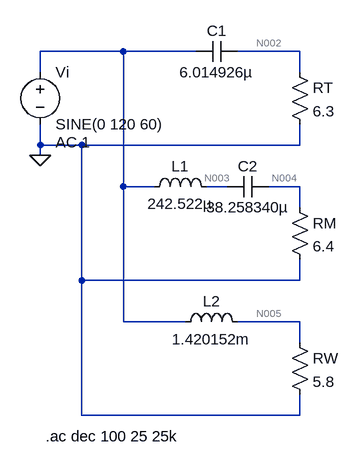
[diagram p0: schematic lab12.asc]
lab12.asc, the LTspice schematic file:
Version 4
SHEET 1 880 680
WIRE -112 -64 -240 -64
WIRE 0 -64 -112 -64
WIRE 160 -64 64 -64
WIRE -240 -32 -240 -64
WIRE 160 -32 160 -64
WIRE -240 80 -240 48
WIRE -176 80 -240 80
WIRE 160 80 160 48
WIRE 160 80 -176 80
WIRE -240 96 -240 80
WIRE -112 144 -112 -64
WIRE -64 144 -112 144
WIRE 48 144 16 144
WIRE 160 144 112 144
WIRE 160 176 160 144
WIRE -176 288 -176 80
WIRE 160 288 160 256
WIRE 160 288 -176 288
WIRE -112 352 -112 144
WIRE -16 352 -112 352
WIRE 160 352 64 352
WIRE 160 384 160 352
WIRE -176 496 -176 288
WIRE 160 496 160 464
WIRE 160 496 -176 496
FLAG -240 96 0
SYMBOL cap 0 -48 R270
WINDOW 0 32 32 VTop 2
WINDOW 3 0 32 VBottom 2
SYMATTR InstName C1
SYMATTR Value 6.014926µ
SYMBOL res 144 -48 R0
SYMATTR InstName RT
SYMATTR Value 6.3
SYMBOL ind -80 160 R270
WINDOW 0 32 56 VTop 2
WINDOW 3 5 56 VBottom 2
SYMATTR InstName L1
SYMATTR Value 242.522µ
SYMBOL cap 48 160 R270
WINDOW 0 32 32 VTop 2
WINDOW 3 0 32 VBottom 2
SYMATTR InstName C2
SYMATTR Value 38.258340µ
SYMBOL res 144 160 R0
SYMATTR InstName RM
SYMATTR Value 6.4
SYMBOL ind -32 368 R270
WINDOW 0 32 56 VTop 2
WINDOW 3 5 56 VBottom 2
SYMATTR InstName L2
SYMATTR Value 1.420152m
SYMBOL res 144 368 R0
SYMATTR InstName RW
SYMATTR Value 5.8
SYMBOL voltage -240 -48 R0
WINDOW 123 24 124 Left 2
WINDOW 39 0 0 Left 2
SYMATTR Value2 AC 1
SYMATTR InstName Vi
SYMATTR Value SINE(0 120 60)
TEXT -232 528 Left 2 !.ac dec 100 25 25k

The netlist it stands for:
* lab12.asc
C1 N001 N002 6.014926µ
RT N002 0 6.3
L1 N001 N003 242.522µ
C2 N003 N004 38.258340µ
RM N004 0 6.4
L2 N001 N005 1.420152m
RW N005 0 5.8
Vi N001 0 SINE(0 120 60) AC 1
.ac dec 100 25 25k
.backanno
.end

* Results of the author's LTspice run, read from the files saved beside the schematic
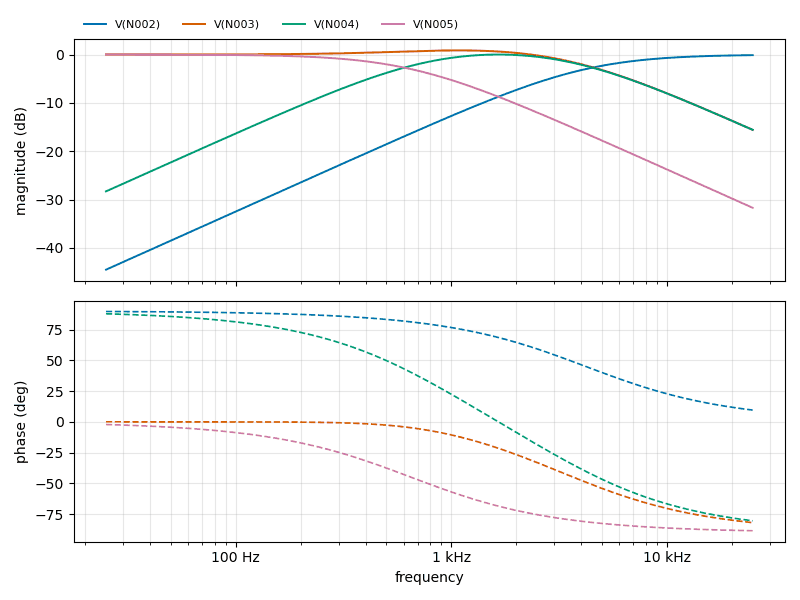
[diagram p1: AC Analysis of lab12.asc, plotted from the saved traces]
* AC Analysis, 1 run:
*   V(N002): -44.51 dB at 25 Hz, -0.12 dB at 25 kHz, peak -0.12 dB at 25 kHz, 3 dB below the peak at 4.086 kHz
*   V(N003): 0.00 dB at 25 Hz, -15.57 dB at 25 kHz, peak 0.85 dB at 1.066 kHz, 3 dB below the peak at 4.133 kHz
*   V(N004): -28.30 dB at 25 Hz, -15.58 dB at 25 kHz, peak -0.00 dB at 1.652 kHz, 3 dB below the peak at 572 Hz and 4.773 kHz
*   V(N005): -0.01 dB at 25 Hz, -31.70 dB at 25 kHz, peak -0.01 dB at 25 Hz, 3 dB below the peak at 651 Hz